# EAGLE design 2_digital_a (EAGLE 6.4)
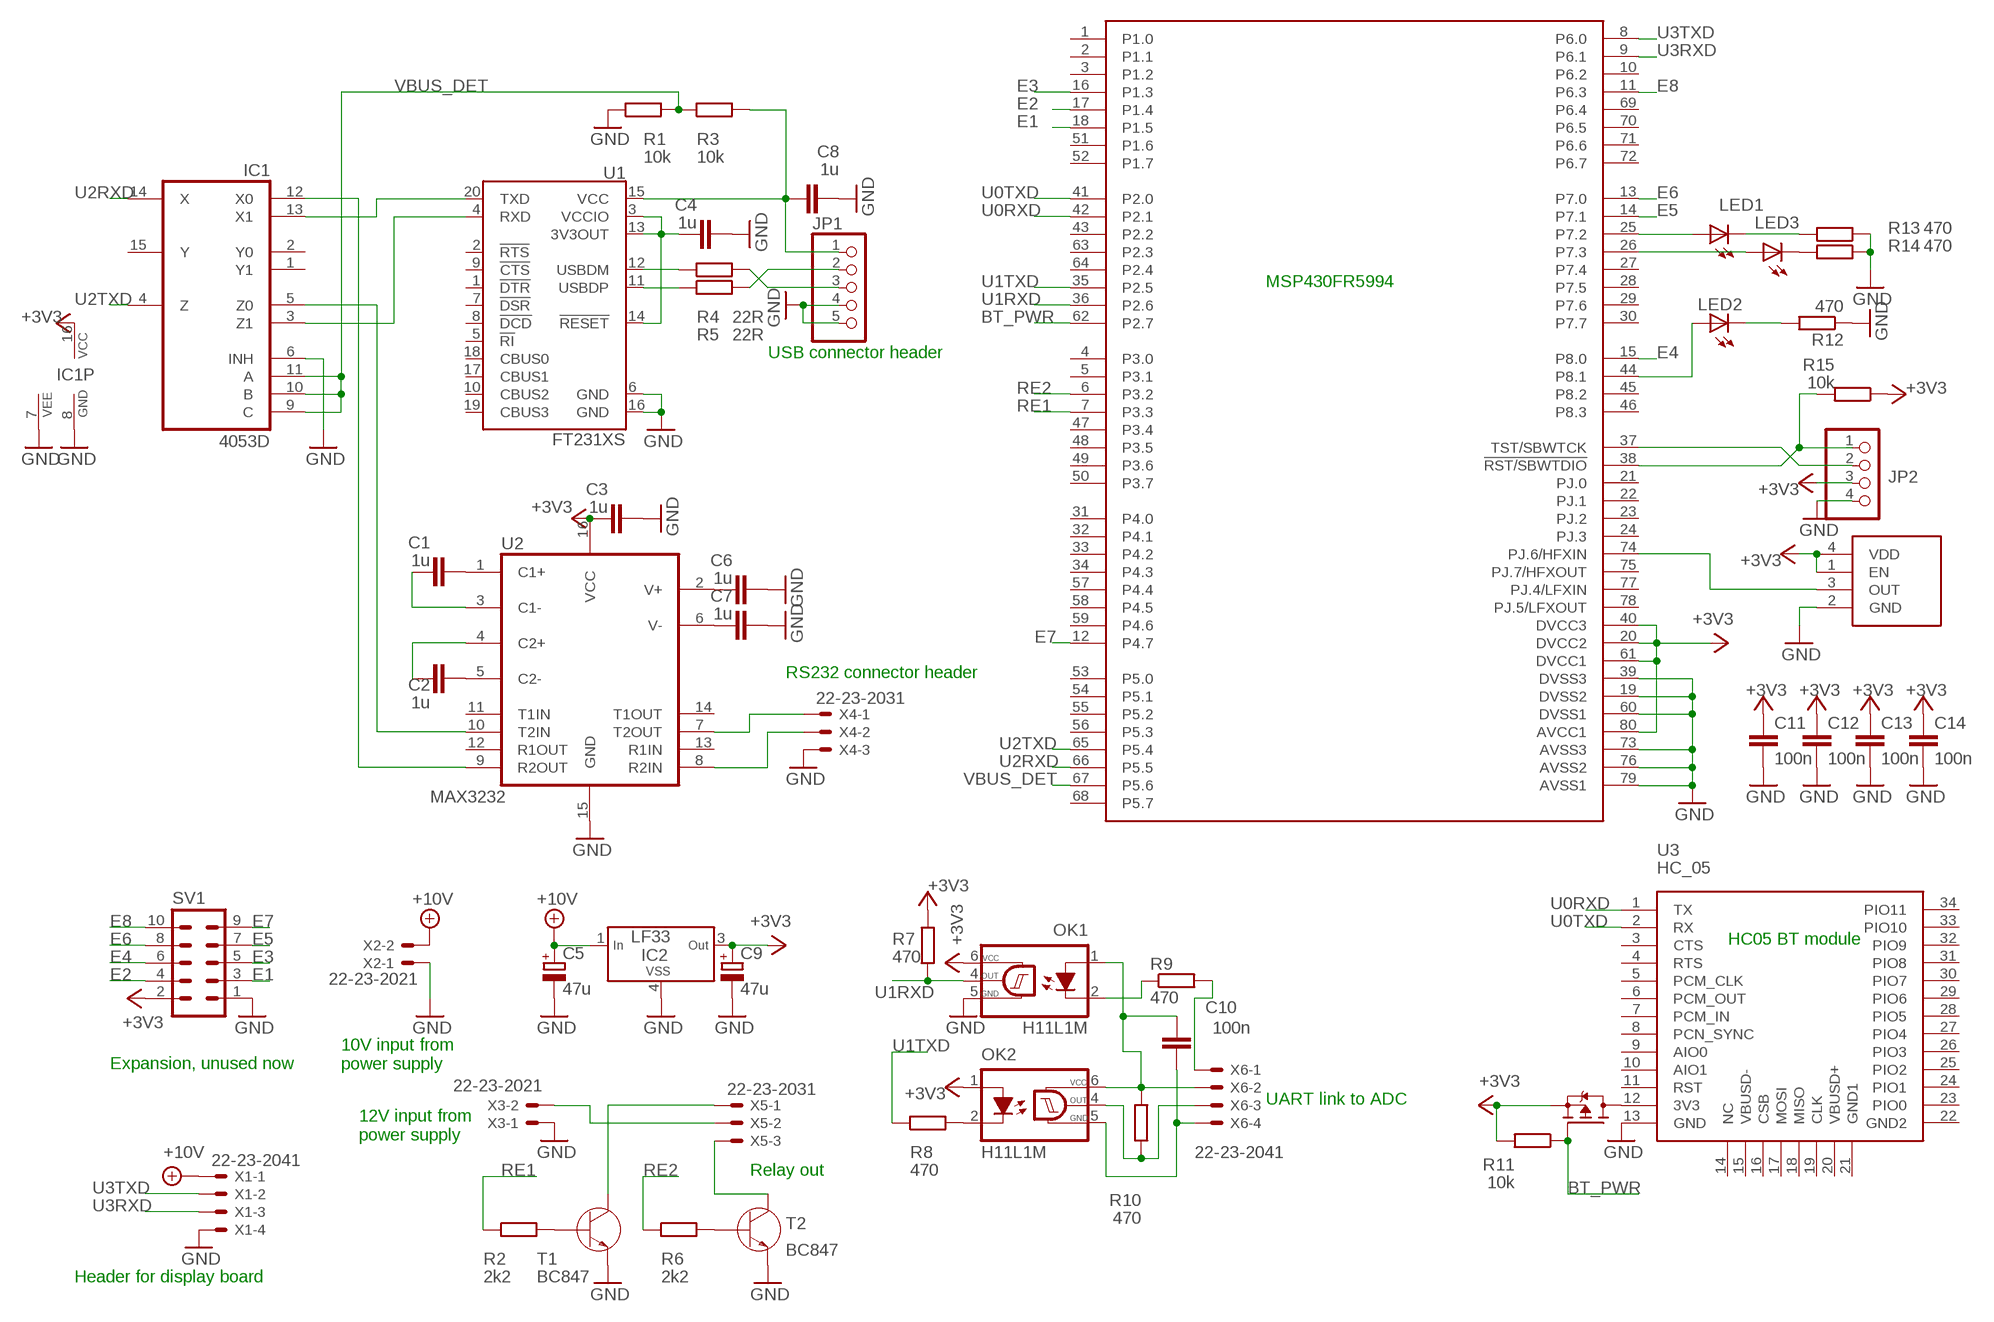
[diagram p0: schematic, sheet 1]

## Parts
C1  1u  C_0806  [R0805]
C2  1u  C_0806  [R0805]
C3  1u  C_0806  [R0805]
C4  1u  C_0806  [R0805]
C5  47u  CPOL-EUSMCC  [SMC_C]
C6  1u  C_0806  [R0805]
C7  1u  C_0806  [R0805]
C8  1u  C_0806  [R0805]
C9  47u  CPOL-EUSMCC  [SMC_C]
C10  100n  C_0603  [0603]
C11  100n  C_0603  [0603]
C12  100n  C_0603  [0603]
C13  100n  C_0603  [0603]
C14  100n  C_0603  [0603]
IC1  4053D  [SO16]
IC2  LF33  LF33-DPAK  [DPAK]
IC3  MSP430FR5994  [QFP_05_80]
JP1  PINHD-1X05_2.54  [1X05]
JP2  PINHD-1X04_2.54  [1X04]
LED1  LEDCHIPLED_0805  [CHIPLED_0805]
LED2  LEDCHIPLED_0805  [CHIPLED_0805]
LED3  LEDCHIPLED_0805  [CHIPLED_0805]
O1  OSC5032  [OSC_5032]
OK1  H11L1M  [DIL06]
OK2  H11L1M  [DIL06]
R1  10k  R_0805  [R0805]
R2  2k2  R_0805  [R0805]
R3  10k  R_0805  [R0805]
R4  22R  R_0805  [R0805]
R5  22R  R_0805  [R0805]
R6  2k2  R_0805  [R0805]
R7  470  R_0805  [R0805]
R8  470  R_0805  [R0805]
R9  470  R_0805  [R0805]
R10  470  R_0805  [R0805]
R11  10k  R_0805  [R0805]
R12  470  R_0805  [R0805]
R13  470  R_0805  [R0805]
R14  470  R_0805  [R0805]
R15  10k  R_0805  [R0805]
SV1  ML10  [ML10]
T1  BC847  [SOT23]
T2  BC847  [SOT23]
U1  FT231XS  [SSOP20_L]
U2  MAX3232  MAX232SOIC16  [SO016]
U3  HC_05  [BLUETOOTH_SMD]
U$1  Si2333  BSS84  [SOT23-3]
X1  22-23-2041  [22-23-2041]
X2  22-23-2021  [22-23-2021]
X3  22-23-2021  [22-23-2021]
X4  22-23-2031  [22-23-2031]
X5  22-23-2031  [22-23-2031]
X6  22-23-2041  [22-23-2041]

## Nets
+3V3: C3.1 C9.+ C11.1 C12.1 C13.1 C14.1 IC1.16(VCC) IC2.3(OUT) IC3.20(DVCC2) IC3.40(DVCC3) IC3.61(DVCC1) IC3.80(AVCC1) JP2.3 O1.1(EN) O1.4(VDD) OK1.6(VCC) OK2.1(A) R7.1 R11.2 R15.1 SV1.2 U2.16(VCC) U$1.2(S)
+10V: C5.+ IC2.1(IN) X1.1 X2.2
BT_PWR: IC3.62(P2.7) R11.1 U$1.1(G)
E1: IC3.18(P1.5) SV1.3
E2: IC3.17(P1.4) SV1.4
E3: IC3.16(P1.3) SV1.5
E4: IC3.15(P8.0) SV1.6
E5: IC3.14(P7.1) SV1.7
E6: IC3.13(P7.0) SV1.8
E7: IC3.12(P4.7) SV1.9
E8: IC3.11(P6.3) SV1.10
GND: C3.2 C4.2 C5.- C6.2 C7.2 C8.2 C9.- C11.2 C12.2 C13.2 C14.2 IC1.6(INH) IC1.7(VEE) IC1.8(GND) IC2.4(VSS) IC3.19(DVSS2) IC3.39(DVSS3) IC3.60(DVSS1) IC3.73(AVSS3) IC3.76(AVSS2) IC3.79(AVSS1) JP1.4 JP1.5 JP2.4 O1.2(GND) OK1.5(GND) R1.1 R12.1 R13.1 R14.1 SV1.1 T1.2(E) T2.2(E) U1.6(GND) U1.16(GND) U2.15(GND) U3.13(GND) X1.4 X2.1 X3.1 X4.3
N$5: IC3.38(!RST/SBWTDIO) JP2.1 R15.2
N$6: IC3.37(TST/SBWTCK) JP2.2
N$7: OK2.2(C) R8.2
N$8: R2.2 T1.1(B)
N$9: C10.1 OK1.1(A) OK2.6(VCC) R10.2 X6.2
N$10: OK1.2(C) R9.1
N$11: OK2.4(OUT) R10.1 X6.3
N$12: C10.2 OK2.5(GND) X6.4
N$13: R9.2 X6.1
N$14: LED2.C R12.2
N$15: IC3.44(P8.1) LED2.A
N$16: R6.2 T2.1(B)
N$17: T1.3(C) X5.1
N$18: T2.3(C) X5.3
N$19: X3.2 X5.2
N$20: IC3.25(P7.2) LED1.A
N$21: IC3.26(P7.3) LED3.A
N$22: U3.12(3V3) U$1.3(D)
N$23: LED3.C R14.2
N$24: LED1.C R13.2
N$26: IC3.74(PJ.6/HFXIN) O1.3(OUT)
N$43: IC1.13(X1) U1.20(TXD)
N$45: IC1.3(Z1) U1.4(RXD)
N$46: C8.1 JP1.1 R3.2 U1.15(VCC)
N$47: R5.1 U1.11(USBDP)
N$48: JP1.2 R5.2
N$49: JP1.3 R4.2
N$50: R4.1 U1.12(USBDM)
N$51: C4.1 U1.3(VCCIO) U1.13(3V3OUT) U1.14(!RESET)
N$52: IC1.12(X0) U2.9(R2OUT)
N$53: IC1.5(Z0) U2.10(T2IN)
N$54: C7.1 U2.6(V-)
N$55: C6.1 U2.2(V+)
N$56: C2.2 U2.5(C2-)
N$57: C1.2 U2.1(C1+)
N$58: U2.8(R2IN) X4.2
N$59: C1.1 U2.3(C1-)
N$60: C2.1 U2.4(C2+)
N$61: U2.7(T2OUT) X4.1
RE1: IC3.7(P3.3) R2.1
RE2: IC3.6(P3.2) R6.1
U0RXD: IC3.42(P2.1) U3.1(TX)
U0TXD: IC3.41(P2.0) U3.2(RX)
U1RXD: IC3.36(P2.6) OK1.4(OUT) R7.2
U1TXD: IC3.35(P2.5) R8.1
U2RXD: IC1.14(X) IC3.66(P5.5)
U2TXD: IC1.4(Z) IC3.65(P5.4)
U3RXD: IC3.9(P6.1) X1.3
U3TXD: IC3.8(P6.0) X1.2
VBUS_DET: IC1.9(C) IC1.10(B) IC1.11(A) IC3.67(P5.6) R1.2 R3.1
Unconnected: IC1.1(Y1) IC1.2(Y0) IC1.15(Y) IC3.1(P1.0) IC3.2(P1.1) IC3.3(P1.2) IC3.4(P3.0) IC3.5(P3.1) IC3.10(P6.2) IC3.21(PJ.0) IC3.22(PJ.1) IC3.23(PJ.2) IC3.24(PJ.3) IC3.27(P7.4) IC3.28(P7.5) IC3.29(P7.6) IC3.30(P7.7) IC3.31(P4.0) IC3.32(P4.1) IC3.33(P4.2) IC3.34(P4.3) IC3.43(P2.2) IC3.45(P8.2) IC3.46(P8.3) IC3.47(P3.4) IC3.48(P3.5) IC3.49(P3.6) IC3.50(P3.7) IC3.51(P1.6) IC3.52(P1.7) IC3.53(P5.0) IC3.54(P5.1) IC3.55(P5.2) IC3.56(P5.3) IC3.57(P4.4) IC3.58(P4.5) IC3.59(P4.6) IC3.63(P2.3) IC3.64(P2.4) IC3.68(P5.7) IC3.69(P6.4) IC3.70(P6.5) IC3.71(P6.6) IC3.72(P6.7) IC3.75(PJ.7/HFXOUT) IC3.77(PJ.4/LFXIN) IC3.78(PJ.5/LFXOUT) U1.1(!DTR) U1.2(!RTS) U1.5(!RI) U1.7(!DSR) U1.8(!DCD) U1.9(!CTS) U1.10(CBUS2) U1.17(CBUS1) U1.18(CBUS0) U1.19(CBUS3) U2.11(T1IN) U2.12(R1OUT) U2.13(R1IN) U2.14(T1OUT) U3.3(CTS) U3.4(RTS) U3.5(PCM_CLK) U3.6(PCM_OUT) U3.7(PCM_IN) U3.8(PCN_SYNC) U3.9(AIO0) U3.10(AIO1) U3.11(RST) U3.14(NC) U3.15(VBUSD-) U3.16(CSB) U3.17(MOSI) U3.18(MISO) U3.19(CLK) U3.20(VBUSD+) U3.21(GND1) U3.22(GND2) U3.23(PIO0) U3.24(PIO1) U3.25(PIO2) U3.26(PIO3) U3.27(PIO4) U3.28(PIO5) U3.29(PIO6) U3.30(PIO7) U3.31(PIO8) U3.32(PIO9) U3.33(PIO10) U3.34(PIO11)

## Notes on the sheet
- MSP430FR5994
- USB connector header
- RS232 connector header
- HC05 BT module
- Expansion, unused now
- 10V input from 
  power supply
- UART link to ADC
- 12V input from 
  power supply
- Relay out
- Header for display board

## Library data of the parts
C1-C4 C6-C8 C10-C14 = _moja:C
C5 C9 = _rcl:CPOL-EU: POLARIZED CAPACITOR, European symbol
IC1 = 40xx:4053: Triple 2-channel ANALOG MULTIPLEXER
IC2 = _mcom6:LF33
IC3 = _mcs1:MSP430FR5994
JP1 = pinhead-2:PINHD-1X05: PIN HEADER
JP2 = pinhead-2:PINHD-1X04: PIN HEADER
LED1-LED3 = led:LED: LED OSRAM: - CHIPLED LG R971, LG N971, LY N971, LG Q971, LY Q971, LO R971, LY R971 LH N974, LH R974 LS Q976, LO Q976, LY Q976 LO Q996 - Hyper CHIPLED LW Q18S LB Q993, LB Q99A, LB R99A - SideLED LS A670, LO A670, LY A670, LG A670, LP A670 LB A673, LV A673, LT A673, LW A673 LH A674 LY A675 LS A676, LA A676, LO A676, LY A676, LW A676 LS A679, LY A679, LG A679 - Hyper Micro SIDELED® LS Y876, LA Y876, LO Y876, LY Y876 LT Y87S - SmartLED LW L88C, LW L88S LB L89C, LB L89S, LG L890 LS L89K, LO L89K, LY L89K LS L896, LA L896, LO L896, LY L896 - TOPLED LS T670, LO T670, LY T670, LG T670, LP T670 LSG T670, LSP T670, LSY T670, LOP T670, LYG T670 LG T671, LOG T671, LSG T671 LB T673, LV T673, LT T673, LW T673 LH T674 LS T676, LA T676, LO T676, LY T676, LB T676, LH T676, LSB T676, LW T676 LB T67C, LV T67C, LT T67C, LS T67K, LO T67K, LY T67K, LW E67C LS E67B, LA E67B, LO E67B, LY E67B, LB E67C, LV E67C, LT E67C LW T67C LS T679, LY T679, LG T679 LS T770, LO T770, LY T770, LG T770, LP T770 LB T773, LV T773, LT T773, LW T773 LH T774 LS E675, LA E675, LY E675, LS T675 LS T776, LA T776, LO T776, LY T776, LB T776 LHGB T686 LT T68C, LB T68C - Hyper Mini TOPLED® LB M676 - Mini TOPLED Santana® LG M470 LS M47K, LO M47K, LY M47K Source: http://www.osram.convergy.de LUXEON: - LUMILED® LXK2-PW12-R00, LXK2-PW12-S00, LXK2-PW14-U00, LXK2-PW14-V00 LXK2-PM12-R00, LXK2-PM12-S00, LXK2-PM14-U00 LXK2-PE12-Q00, LXK2-PE12-R00, LXK2-PE12-S00, LXK2-PE14-T00, LXK2-PE14-U00 LXK2-PB12-K00, LXK2-PB12-L00, LXK2-PB12-M00, LXK2-PB14-N00, LXK2-PB14-P00, LXK2-PB14-Q00 LXK2-PR12-L00, LXK2-PR12-M00, LXK2-PR14-Q00, LXK2-PR14-R00 LXK2-PD12-Q00, LXK2-PD12-R00, LXK2-PD12-S00 LXK2-PH12-R00, LXK2-PH12-S00 LXK2-PL12-P00, LXK2-PL12-Q00, LXK2-PL12-R00 Source: www.luxeon.com KINGBRIGHT: KA-3528ASYC Source: www.kingbright.com
O1 = _moja:OSC
OK1 OK2 = optocoupler:H11L*M: 6-Pin DIP Optocoupler Source: http://www.fairchildsemi.com/ds/H1/H11L2-M.pdf
R1-R15 = _moja:R
SV1 = con-harting-ml:ML10: HARTING
T1 T2 = _mcom6:BC847
U1 = SparkFun-DigitalIC:FT231X: FTDI FT231X Full Speed USB to Full-handshake UART This USB2.0 Full Speed IC offers a compact bridge to full handshake UART interfaces. The device is a UART, capable of operating up to 3MBaud, with low power consumption (8mA). The FT231X includes the complete FT-X series feature set and enables USB to be added into a system design quickly and easily over a UART interface.
U2 = SparkFun:MAX232: RS232 Transceiver Very common IC. This is generically called 'MAX232', but works with the 3V equivalent MAX3232 generic ICs. Field tested and mother approved. Spark Fun Electronics SKU : COM-00316 (DIP) and COM-00589 (SMD)
U3 = hc05:HC_05: HC-05 Bluetooth Module
U$1 = _moja:BSS84
X1 X6 = con-molex:22-23-2041: .100" (2.54mm) Center Header - 4 Pin; MF: MOLEX; MPN: 22-23-2041; OC_FARNELL: 1462920; OC_NEWARK: 38C0355
X2 X3 = con-molex:22-23-2021: .100" (2.54mm) Center Header - 2 Pin; MF: MOLEX; MPN: 22-23-2021; OC_FARNELL: 1462926; OC_NEWARK: 25C3832
X4 X5 = con-molex:22-23-2031: .100" (2.54mm) Center Header - 3 Pin; MF: MOLEX; MPN: 22-23-2031; OC_FARNELL: 1462950; OC_NEWARK: 30C0862

## Board
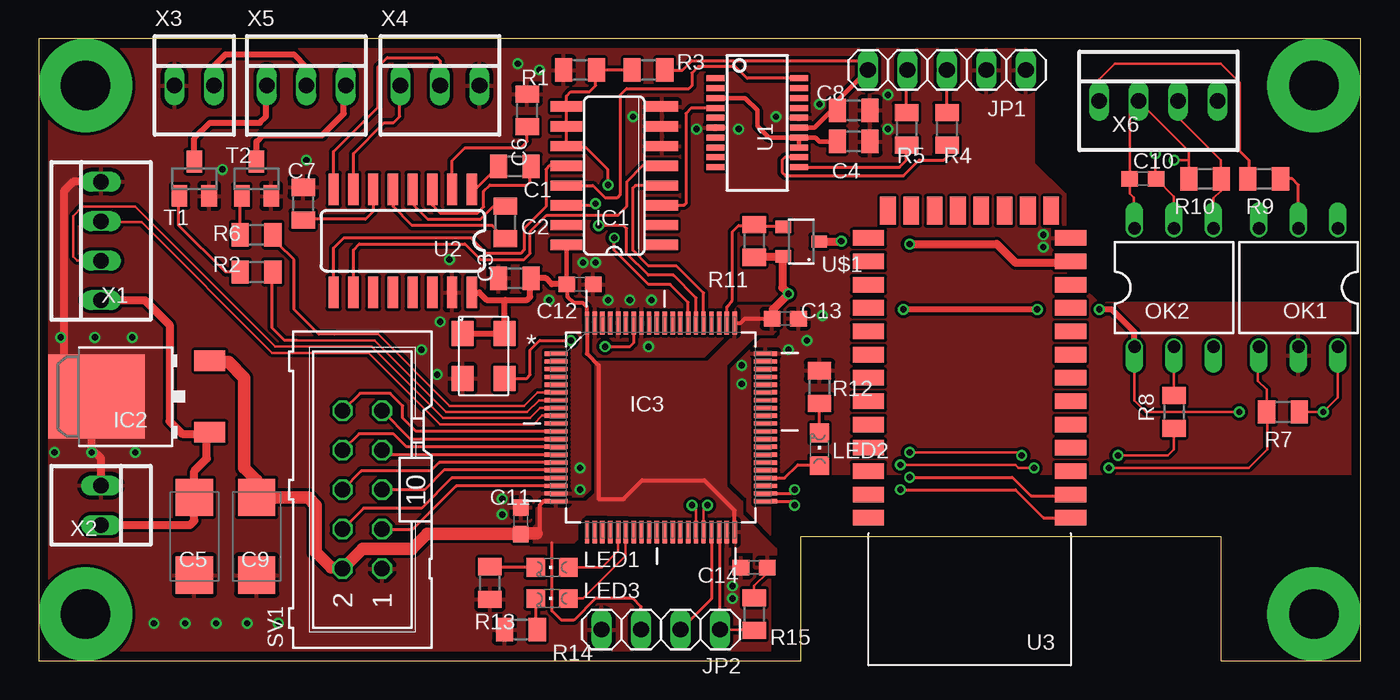
[diagram p1: board, top side]
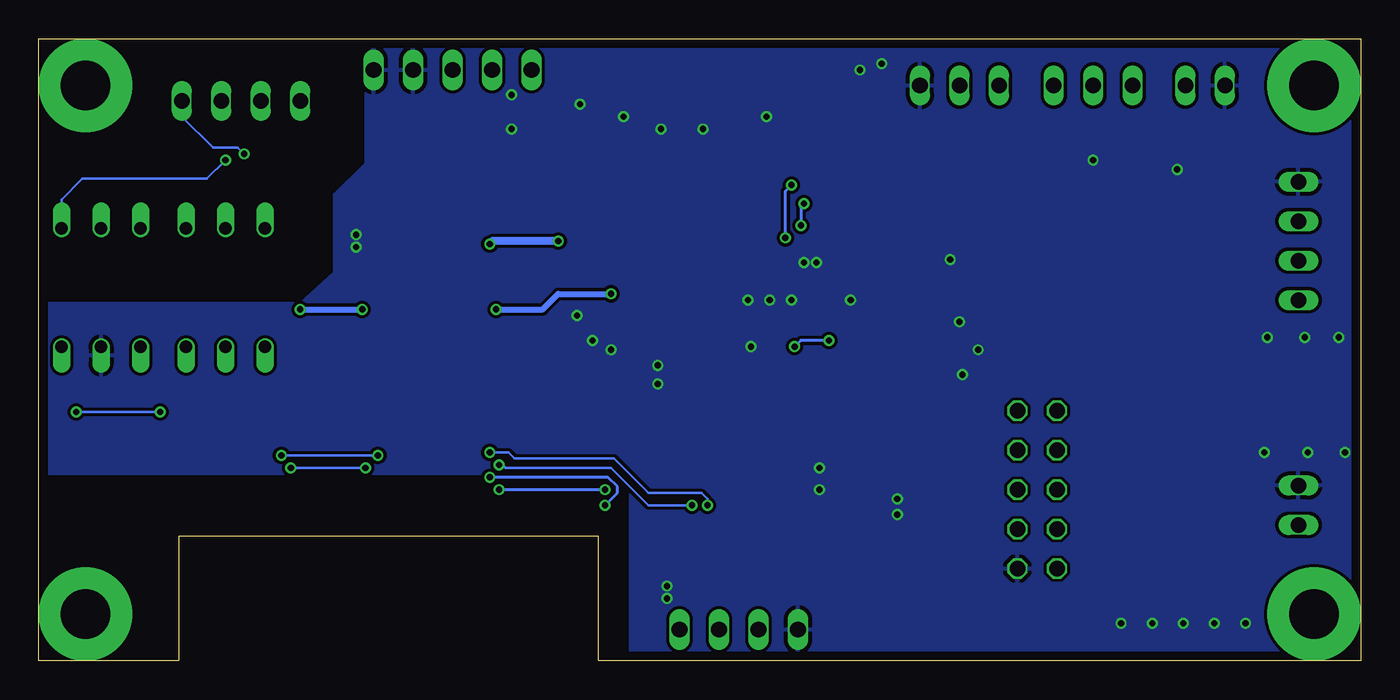
[diagram p2: board, bottom side, seen from below]

Size 85 x 40 mm. Coordinates in mm from the lower left corner, seen from the top.
Outline: 0,0 49,0 49,8 76,8 76,0 85,0 85,40 0,40 0,0
Copper layers (1*16): Top 0.035mm / dielectric 1.5mm / Bottom 0.035mm
Design rules "ch_6": minimum track width 0.15mm, minimum drill 0.4mm, track to track 0.2mm, track to pad 0.2mm, pad to pad 0.2mm, via to via 0.2mm, smd to smd 0.2mm, copper to edge 0.6mm, drill to drill 8mil, minimum pad ring 0.15mm, minimum via ring 0.15mm, stop-mask expansion 4mil, vias tented up to drill 0mil, thermal gap 10mil

### Footprints (pad centres in the part's own frame; a part is rotated, then mirrored left to right if it is on the bottom)
R0805 = smd 1.1 x 1.5: 1 -1.05,0; 2 1.05,0
SMC_C = smd 2.4 x 2.4: + -2.5,0; - 2.5,0
0603 = smd 1.067 x 1: 1 -0.85,0; 2 0.85,0
SO16 = smd 0.66 x 2.032: 1 -4.445,-3.073; 2 -3.175,-3.073; 3 -1.905,-3.073; 4 -0.635,-3.073; 5 0.635,-3.073; 6 1.905,-3.073; 7 3.175,-3.073; 8 4.445,-3.073; 9 4.445,3.073; 10 3.175,3.073; 11 1.905,3.073; 12 0.635,3.073; 13 -0.635,3.073; 14 -1.905,3.073; 15 -3.175,3.073; 16 -4.445,3.073
DPAK = smd 1.3 x 2: 1 -2.3,-4.793; 3 2.3,-4.793 | smd 5.4 x 6.2: 4 -0.01,2.5
QFP_05_80 = smd 1.473 x 0.279: 1 -6.731,4.75; 2 -6.731,4.242; 3 -6.731,3.759; 4 -6.731,3.251; 5 -6.731,2.743; 6 -6.731,2.261; 7 -6.731,1.753; 8 -6.731,1.245; 9 -6.731,0.762; 10 -6.731,0.254; 11 -6.731,-0.254; 12 -6.731,-0.762; 13 -6.731,-1.245; 14 -6.731,-1.753; 15 -6.731,-2.261; 16 -6.731,-2.743; 17 -6.731,-3.251; 18 -6.731,-3.759; 19 -6.731,-4.242; 20 -6.731,-4.75; 41 6.731,-4.75; 42 6.731,-4.242; 43 6.731,-3.759; 44 6.731,-3.251; 45 6.731,-2.743; 46 6.731,-2.261; 47 6.731,-1.753; 48 6.731,-1.245; 49 6.731,-0.762; 50 6.731,-0.254; 51 6.731,0.254; 52 6.731,0.762; 53 6.731,1.245; 54 6.731,1.753; 55 6.731,2.261; 56 6.731,2.743; 57 6.731,3.251; 58 6.731,3.759; 59 6.731,4.242; 60 6.731,4.75 | smd 0.279 x 1.473: 21 -4.75,-6.731; 22 -4.242,-6.731; 23 -3.759,-6.731; 24 -3.251,-6.731; 25 -2.743,-6.731; 26 -2.261,-6.731; 27 -1.753,-6.731; 28 -1.245,-6.731; 29 -0.762,-6.731; 30 -0.254,-6.731; 31 0.254,-6.731; 32 0.762,-6.731; 33 1.245,-6.731; 34 1.753,-6.731; 35 2.261,-6.731; 36 2.743,-6.731; 37 3.251,-6.731; 38 3.759,-6.731; 39 4.242,-6.731; 40 4.75,-6.731; 61 4.75,6.731; 62 4.242,6.731; 63 3.759,6.731; 64 3.251,6.731; 65 2.743,6.731; 66 2.261,6.731; 67 1.753,6.731; 68 1.245,6.731; 69 0.762,6.731; 70 0.254,6.731; 71 -0.254,6.731; 72 -0.762,6.731; 73 -1.245,6.731; 74 -1.753,6.731; 75 -2.261,6.731; 76 -2.743,6.731; 77 -3.251,6.731; 78 -3.759,6.731; 79 -4.242,6.731; 80 -4.75,6.731
1X05 = drill 1.016 long: 1 -5.08,0; 2 -2.54,0; 3 0,0; 4 2.54,0; 5 5.08,0
1X04 = drill 1.016 long: 1 -3.81,0; 2 -1.27,0; 3 1.27,0; 4 3.81,0
CHIPLED_0805 = smd 1.2 x 1.2: A 0,-1.05; C 0,1.05
OSC_5032 = smd 1.6 x 1.4: 1 -1.45,-1.35; 2 1.45,-1.35; 3 1.45,1.35; 4 -1.45,1.35
DIL06 = drill 0.813 offset: 1 -2.54,-3.81; 2 0,-3.81; 3 2.54,-3.81; 4 2.54,3.81; 5 0,3.81; 6 -2.54,3.81
ML10 = drill 1 octagon: 1 -5.08,-1.27; 2 -5.08,1.27; 3 -2.54,-1.27; 4 -2.54,1.27; 5 0,-1.27; 6 0,1.27; 7 2.54,-1.27; 8 2.54,1.27; 9 5.08,-1.27; 10 5.08,1.27
SOT23 = smd 1 x 1.4: 1 -0.95,-1.1; 2 0.95,-1.1; 3 0,1.1
SSOP20_L = smd 0.381 x 1.143: 1 -2.857,-2.68; 2 -2.223,-2.68; 3 -1.587,-2.68; 4 -0.953,-2.68; 5 -0.318,-2.68; 6 0.318,-2.68; 7 0.953,-2.68; 8 1.587,-2.68; 9 2.223,-2.68; 10 2.857,-2.68; 11 2.857,2.68; 12 2.223,2.68; 13 1.587,2.68; 14 0.953,2.68; 15 0.318,2.68; 16 -0.318,2.68; 17 -0.953,2.68; 18 -1.587,2.68; 19 -2.223,2.68; 20 -2.857,2.68
SO016 = smd 0.66 x 2.032: 1 -4.445,-3.315; 2 -3.175,-3.315; 3 -1.905,-3.315; 4 -0.635,-3.315; 5 0.635,-3.315; 6 1.905,-3.315; 7 3.175,-3.315; 8 4.445,-3.315; 9 4.445,3.315; 10 3.175,3.315; 11 1.905,3.315; 12 0.635,3.315; 13 -0.635,3.315; 14 -1.905,3.315; 15 -3.175,3.315; 16 -4.445,3.315
BLUETOOTH_SMD = smd 2 x 1: 1 -6.35,3.81; 2 -6.35,2.31; 3 -6.35,0.81; 4 -6.35,-0.69; 5 -6.35,-2.19; 6 -6.35,-3.69; 7 -6.35,-5.19; 8 -6.35,-6.69; 9 -6.35,-8.19; 10 -6.35,-9.69; 11 -6.35,-11.19; 12 -6.35,-12.69; 13 -6.35,-14.19; 22 6.65,-14.19; 23 6.65,-12.69; 24 6.65,-11.19; 25 6.65,-9.69; 26 6.65,-8.19; 27 6.65,-6.69; 28 6.65,-5.19; 29 6.65,-3.69; 30 6.65,-2.19; 31 6.65,-0.69; 32 6.65,0.81; 33 6.65,2.31; 34 6.65,3.81 | smd 1 x 1.8: 14 -5.1,-15.94; 15 -3.6,-15.94; 16 -2.1,-15.94; 17 -0.6,-15.94; 18 0.9,-15.94; 19 2.4,-15.94; 20 3.9,-15.94; 21 5.4,-15.94
SOT23-3 = smd 0.8 x 1: 1 0.91,1.13; 2 -0.99,1.13; 3 -0.04,-1.17
22-23-2041 = drill 1 long: 1 -3.81,0; 2 -1.27,0; 3 1.27,0; 4 3.81,0
22-23-2021 = drill 1 long: 1 -1.27,0; 2 1.27,0
22-23-2031 = drill 1 long: 1 -2.54,0; 2 0,0; 3 2.54,0

### Placement (x,y rotation side)
C1  30.6,31.8 180 top
C2  30,28.2 270 top
C3  30.6,24.6 180 top
C4  52.4,33.4 0 top
C5  10,8 270 top
C6  31.4,35.4 90 top
C7  17,29.4 90 top
C8  52.4,35.4 0 top
C9  14,8 270 top
C10  71,31 0 top
C11  31,9 90 top
C12  34.8,24.2 0 top
C13  48,22 0 top
C14  46,6 180 top
IC1  37,31.2 90 top
IC2  6.2,17 90 top
IC3  40,15 0 top
JP1  58.4,38 0 top
JP2  40,2 180 top
LED1  33,6 90 top
LED2  50.2,13.6 0 top
LED3  33,4 90 top
O1  28.6,19.6 270 top
OK1  81,24 180 top
OK2  73,24 0 top
R1  34.8,38 0 top
R2  14,25 180 top
R3  39.2,38 0 top
R4  58.4,34.2 90 top
R5  55.8,34.2 90 top
R6  14,27.4 180 top
R7  80,16 180 top
R8  73,16 90 top
R9  78.8,31 180 top
R10  75,31 180 top
R11  46,27 270 top
R12  50.2,17.6 270 top
R13  29,5 90 top
R14  31,2 0 top
R15  46,3 270 top
SV1  20.8,11 90 top
T1  10,31 0 top
T2  14,31 0 top
U1  46.2,34.6 270 top
U2  23.4,27 180 top
U3  60,13 180 top
U$1  49,27 90 top
X1  4,27 90 top
X2  4,10 270 top
X3  10,37 0 top
X4  25.8,37 0 top
X5  17.2,37 0 top
X6  72,36 0 top

### Tracks (layer width: path | path; a pad name or v marks a point on that pad's centre or on a via)
+3V3  (via drill 0.4)
  Top 0.16: C14.1 46.85,5.65 46,4.8 R15.1 | OK2.1 70.46,16.74 71.2,16 v77.2,16 | R7.1 v82.6,16 83.54,16.94 OK1.6
  Top 0.2: 47.2,22.05 C13.1 | 47.81,25.95 U$1.2 | JP2.3 38.73,3.47 38.2,4 35.8,4 34.4,2.6 33.6,2.6 33,3.2 33,7.6
  Top 0.25: IC3.20 32.45,10.25 32.2,10 32.2,8.4 32,8.2 | 31.05,8.2 C11.1 | IC3.40 44.75,9.65 42.8,11.6 38.8,11.6 37.6,10.4 36,10.4 36,19 35.25,19.75 IC3.80 35.25,22.75 35,23 34.4,23 34,23.4 34,24.15 C12.1 | IC3.61 45.13,21.73 45.4,22 C13.1 | 46.8,6.05 C14.1
  Top 0.3: IC1.16 33.93,24.22 C12.1
  Top 0.4: OK2.1 70.46,21.14 69,22.6 v68.2,22.6 | v64.2,22.6 v55.6,22.6 | 33.93,24.22 32.98,24.22 32.6,24.6 C3.1 31.6,24.55 31.6,23.4 31.4,23.2 30,23.2 | U2.16 28.32,23.68 28.8,23.2 30,23.2 | 30,23.2 29.95,23.15 O1.4 O1.1
  Top 0.5: C9.+ 14,11.6 | 10.89,19.2 IC2.3 | 47.2,22.05 47.2,22.6 v48.2,23.6 47.81,23.99 47.81,25.95 R11.2
  Top 0.8: 14,11.6 13.2,12.4 13.2,18.2 12.2,19.2 10.89,19.2 | C9.+ 17.3,10.5 17.8,10 17.8,7 18.8,6 SV1.2 20.81,7.2 24,7.2 24.95,8.15 C11.1 | 32,8.2 31.05,8.2
  Bottom 0.16: v77.2,16 v82.6,16
  Bottom 0.4: v68.2,22.6 v64.2,22.6 | v55.6,22.6 52.6,22.6 51.6,23.6 v48.2,23.6
  pour Top: 31.2,8.6 31.8,8.6 32,8.8 32,9.8 32.4,10.2 35.2,10.2 35.8,10.8 35.8,19 36,19.2 43,19.2 44.8,21 44.8,22.6 45,22.8 47.4,22.8 47.4,21.2 47.2,21 46.2,21 44.2,19 44.2,11.2 45.2,10.2 45.2,9.4 47.4,7.2 47.4,6.2 47,5.8 46.2,5.8 46,6 46,7 44.8,7 44.8,9.2 35.2,9.4 34.6,8.8 34.6,7.8 34.4,7.6 31.2,7.6
+10V
  Top 0.5: X2.2 9.73,8.73 10,9 C5.+ 10,12.2 10.8,13 10.8,14.69 IC2.1 10.69,14.6 9.2,14.6 8.4,15.4 8.4,21.6 6.81,23.19 X1.1
BT_PWR
  Top 0.2: U$1.1 46.14,27.91 R11.1 45.95,28 45,28 44.6,27.6 44.6,23.2 44.24,22.76 IC3.62
E1
  Top 0.2: IC3.18 26.84,11.24 24,8.4 22.13,8.4 SV1.3
E2
  Top 0.2: IC3.17 26.55,11.75 24.6,9.8 20.87,9.8 SV1.4
E3
  Top 0.2: IC3.16 26.06,12.26 24.8,11 SV1.5
E4
  Top 0.2: IC3.15 25.74,12.74 25.2,12.2 20.73,12.2 SV1.6
E5
  Top 0.2: IC3.14 22.36,13.25 SV1.7
E6
  Top 0.2: IC3.13 23.64,13.76 22.8,14.6 20.59,14.6 SV1.8
E7
  Top 0.2: IC3.12 23.91,14.24 SV1.9
E8
  Top 0.2: IC3.11 24.25,14.75 23.4,15.6 23.4,16.4 22.6,17.2 20.65,17.2 SV1.10
GND  (via drill 0.4)
  Top 0.5: X1.4 2.21,30.81 1.6,30.2 1.6,18.89 IC2.4 3.4,16.89 3.4,13.6 4,13 X2.1
  other vias: 29.8,10.4 29.8,9.4 35,25.6 35.8,25.6 48.2,20 49.4,20.6 44.6,4.8 44.6,4 64.6,26.6 64.6,27.4 34.8,11 45.2,19 1.4,20.8 3.6,20.8 6,20.8 1,13.4 3.4,13.4 6.2,13.4 7.4,2.4 11.4,2.4 15.4,2.4 13.4,2.4 9.4,2.4 45.2,17.8 50.4,22.2 34.8,12.4 38.2,35 32.2,38 47.4,35 54.6,36.4 54.6,34.2 45,34.2 32.8,23.2 25.8,21.8 17.2,32.2 30.8,38.4 11.8,31.6 50.2,35.8 42.3,34.2 26.4,25.8 25.6,18.4 36.6,23.2 38,23.2 39.4,23.2 39.2,20.2 24.6,20
  pour Top (rank 2): 0,0 47,0 47,12 85,12 85,23 68.2,23 66,25 66,30 64,32 64,40 0,40
  pour Bottom: 0,0 47,0 47,12 85,12 85,23 68.2,23 66,25 66,30 64,32 64,40 0,40
  pour Top (no thermals): 0,21 0,13 8,13 8,21
N$1  (via drill 3.2 pad 6)
  other vias: 3,3
N$2  (via drill 3.2 pad 6)
  other vias: 3,37
N$3  (via drill 3.2 pad 6)
  other vias: 82,37
N$4  (via drill 3.2 pad 6)
  other vias: 82,3
N$5
  Top 0.2: IC3.38 43.76,2.05 JP2.1 R15.2
N$6
  Top 0.2: IC3.37 43.25,3.98 JP2.2
N$7
  Top 0.16: R8.2 OK2.2
N$8
  Top 0.2: R2.2 12,25 9,28 9,29.85 T1.1
N$9  (via drill 0.4)
  Top 0.16: R10.2 73.95,32.2 | 73.95,32.2 73.95,32.78 X6.2 70.15,35.42 C10.1 70.15,30.05 70.4,29.8 70.4,27.87 OK2.6 | v73,32.2 73.95,32.2
  Bottom 0.16: OK1.1 83.54,29.66 82.2,31 74.2,31 v73,32.2
N$10
  Top 0.2: OK1.2 81,30.6 80.6,31 R9.1
N$11
  Top 0.16: X6.3 73.27,34.93 76,32.2 76,31.05 R10.1 76,30.95 76,30.2 75.54,29.74 OK2.4
N$12  (via drill 0.4)
  Top 0.16: v71.8,32.6 71.8,31.05 C10.2 73,29.85 OK2.5
  Bottom 0.16: X6.4 75.81,35.01 73.8,33 72.2,33 v71.8,32.6
N$13
  Top 0.16: X6.1 68.19,37.39 69.2,38.4 76,38.4 77.2,37.2
  Top 0.2: 77.2,37.2 77.2,32.8 77.8,32.2 77.8,31.05 R9.2
N$14
  Top 0.2: LED2.C R12.2
N$15
  Top 0.2: IC3.44 47.95,11.75 48.8,12.6 50.15,12.6 LED2.A
N$16
  Top 0.2: R6.2 12.95,29.8 T2.1
N$17
  Top 0.4: T1.3 10,33.6 11,34.6 14.2,34.6 14.6,35 14.6,36.94 X5.1
N$18
  Top 0.4: T2.3 14,33.4 14.4,33.8 18.2,33.8 19.6,35.2 19.6,36.74 X5.3
N$19
  Top 0.4: X3.2 11.27,38.27 12,39 16.4,39 17.2,38.2 X5.2
N$20
  Top 0.16: IC3.25 37.26,7.06 36.2,6 LED1.A
N$21
  Top 0.16: IC3.26 37.74,6.74 35,4 LED3.A
N$22  (via drill 0.4)
  Top 0.2: 51.56,26.96 v51.6,27 | 66.26,25.6 U3.12
  Top 0.5: U$1.3 51.56,26.96 | v56,26.8 61.6,26.8 62.8,25.6 66.26,25.6
  Bottom 0.5: v51.6,27 55.8,27 v56,26.8
N$23
  Top 0.2: LED3.C 31.95,2.1 R14.2
N$24
  Top 0.2: LED1.C 29.05,6 R13.2
N$26  (via drill 0.4)
  Top 0.2: O1.3 31.35,18.15 31.6,18.4 31.6,20 32.2,20.6 v34.2,20.6 | v36.4,20.2 38,20.2 38.25,20.45 IC3.74
  Bottom 0.2: v34.2,20.6 36,20.6 v36.4,20.2
N$43
  Top 0.2: IC1.13 35.63,30.57 36.4,29.8 37.2,29.8 37.4,30 37.4,36.4 37.8,36.8 41.8,36.8 42,37 42,37.8 42.4,38.2 44.8,38.2 45.54,37.46 U1.20
N$45
  Top 0.2: U1.4 41.95,35.55 41.6,35.2 41.6,29.4 41.49,29.3 IC1.3
N$46
  Top 0.2: R3.2 41.4,38 42,38.6 52.72,38.6 JP1.1
  Top 0.3: U1.15 49.88,34.28 51,35.4 C8.1 51.35,36.03 JP1.1
N$47
  Top 0.2: U1.11 55.34,31.74 55.8,32.2 R5.1
N$48
  Top 0.2: R5.2 55.8,37.94 JP1.2
N$49
  Top 0.2: R4.2 JP1.3
N$50
  Top 0.2: U1.12 47.98,32.38 47.8,32.2 47.8,31.4 48,31.2 55.6,31.2 56.6,32.2 58.2,32.2 58.4,32.4 R4.1
N$51
  Top 0.3: U1.14 49.95,33.65 50.2,33.4 C4.1 | U1.13 U1.14 | U1.14 46.95,33.65 46.2,34.4 46.2,35.4 45.41,36.19 U1.3
N$52
  Top 0.2: IC1.12 32.84,31.84 32.6,31.6 32.6,29.2 31.2,27.8 31.2,26.4 31,26.2 28.8,26.2 27.8,27.2 19.6,27.2 18.95,26.55 U2.9
N$53
  Top 0.2: U2.10 20.23,26.43 20.6,26.8 27.4,26.8 28.4,25.8 31.2,25.8 31.6,26.2 31.6,27.6 32.65,28.66 37.25,28.66 37.8,29.21 37.8,30.8 38.84,31.84 IC1.5
N$54
  Top 0.2: U2.6 21.5,28.89 21,28.4 17.05,28.4 C7.1
N$55
  Top 0.2: U2.2 26.57,32.17 27.4,33 31,33 31.4,33.4 C6.1
N$56
  Top 0.2: U2.5 22.77,29.23 24,28 29.15,28 C2.2
N$57
  Top 0.2: U2.1 28.07,30.32 C1.2
N$58
  Top 0.2: U2.8 18.95,32.76 21.8,35.6 21.8,38.2 22.4,38.8 25.6,38.8 25.8,38.6 X4.2
N$59
  Top 0.2: U2.3 25.3,29.3 25.8,28.8 28.2,28.8 28.6,29.2 28.6,30.2 29,30.6 31.4,30.6 31.6,30.8 31.6,31.75 C1.1
N$60
  Top 0.2: U2.4 24.04,29.36 25,28.4 28.4,28.4 29.2,29.2 29.95,29.2 C2.1
N$61
  Top 0.2: U2.7 20.23,32.62 22.2,34.6 22.8,34.6 23.2,35 23.2,36.94 X4.1
RE1
  Top 0.16: IC3.7 32.15,16.75 31.4,16 26.2,16 21.6,20.6 16.6,20.6
  Top 0.2: 16.6,20.6 15.8,20.6 15,21.4 15,24.95 R2.1
RE2
  Top 0.16: IC3.6 32.06,17.26 31.2,16.4 26.4,16.4 21.8,21 19,21
  Top 0.2: 19,21 18,21 16.4,22.6 16.4,25.8 15.4,26.8 15.2,26.8 15,27 15,27.35 R6.1
U0RXD  (via drill 0.4)
  Top 0.2: IC3.42 48.36,10.76 v48.6,11 | v55.4,11 62.8,11 64.6,9.2 U3.1
  Bottom 0.2: v48.6,11 v55.4,11
U0TXD  (via drill 0.4)
  Top 0.2: IC3.41 48.35,10.25 v48.6,10 | v56,11.8 62.6,11.8 63.8,10.6 66.26,10.6 U3.2
  Bottom 0.2: v48.6,10 47.8,10.8 47.8,11.2 48.4,11.8 v56,11.8
U1RXD  (via drill 0.4)
  Top 0.16: IC3.36 42.74,9.74 v43,10 | v55.4,12.6 62.8,12.6 63,12.4 v64,12.4 | v68.8,12.4 77.8,12.4 79,13.6 79,15.95 R7.2 78.95,17.45 78.4,18 78.4,20.13 OK1.4
  Bottom 0.16: v43,10 45.8,10 48.2,12.4 55,12.4 55.2,12.6 v55.4,12.6 | v64,12.4 v68.8,12.4
U1TXD  (via drill 0.4)
  Top 0.16: IC3.35 42.26,9.74 v42,10 | v56,13.4 63,13.4 v63.2,13.2 | v69.4,13.2 72.6,13.2 73,13.6 R8.1
  Bottom 0.16: v42,10 42,10.4 42.4,10.8 45.8,10.8 48,13 54.4,13 54.8,13.4 v56,13.4 | v63.2,13.2 63.4,13 63.6,13.2 v69.4,13.2
U2RXD  (via drill 0.4)
  Top 0.2: IC1.14 35.7,29.3 v35.8,29.4 | IC3.66 42.26,23.34 40.8,24.8 39.2,24.8 37.8,26.2 37.8,27.8 37.6,28 v36,28
  Bottom 0.2: v35.8,29.4 36,29.2 v36,28
U2TXD
  Top 0.2: IC3.65 42.74,23.66 41,25.4 39.2,25.4 38.2,26.4 38.2,30.4 38.37,30.57 IC1.4
U3RXD
  Top 0.16: IC3.9 32.36,15.76 31.8,15.2 25.8,15.2 21.2,19.8 15,19.8 6.6,28.2 4.07,28.2 X1.3
U3TXD
  Top 0.16: X1.2 2.47,25.73 2.2,26 2.2,28.6 2.8,29.2 6.2,29.2 15.2,20.2 21.4,20.2 26,15.6 31.6,15.6 32.24,16.25 IC3.8
VBUS_DET  (via drill 0.4)
  Top 0.2: IC3.67 41.75,23.05 40.6,24.2 39.2,24.2 37,26.4 v37,27.2 | v36.6,30.6 36.6,31.6 35.2,33 34.03,33 IC1.11 IC1.10 IC1.9 33.93,36.33 34.2,36.6 35.4,36.6 35.8,37 35.8,37.95 R1.2 R3.1
  Bottom 0.2: v37,27.2 37,30.2 v36.6,30.6